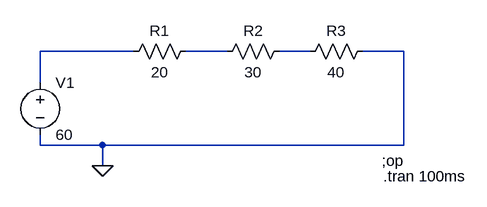
[diagram p0: schematic KVL_own_circuit.asc]
KVL_own_circuit.asc, the LTspice schematic file:
Version 4
SHEET 1 880 680
WIRE 192 64 48 64
WIRE 336 64 272 64
WIRE 464 64 416 64
WIRE 608 64 544 64
WIRE 48 112 48 64
WIRE 48 208 48 192
WIRE 144 208 48 208
WIRE 608 208 608 64
WIRE 608 208 144 208
WIRE 144 240 144 208
FLAG 144 240 0
SYMBOL voltage 48 96 R0
SYMATTR InstName V1
SYMATTR Value 60
SYMBOL res 288 48 R90
WINDOW 0 0 56 VBottom 2
WINDOW 3 32 56 VTop 2
SYMATTR InstName R1
SYMATTR Value 20
SYMBOL res 432 48 R90
WINDOW 0 0 56 VBottom 2
WINDOW 3 32 56 VTop 2
SYMATTR InstName R2
SYMATTR Value 30
SYMBOL res 560 48 R90
WINDOW 0 0 56 VBottom 2
WINDOW 3 32 56 VTop 2
SYMATTR InstName R3
SYMATTR Value 40
TEXT 574 232 Left 2 !;op
TEXT 576 256 Left 2 !.tran 100ms

The netlist it stands for:
* KVL_own_circuit.asc
V1 N001 0 60
R1 N002 N001 20
R2 N003 N002 30
R3 0 N003 40
;op
.tran 100ms
.backanno
.end